# Altium schematic sheet RF_PLL_channel.SchDoc: RFSOC SAWG
size 420 x 297 mm; Author: G.Kasprowicz; CompanyName: WUT; DrawnBy: G.Kasprowicz; Organization: WUT ISE; Address1: Warsaw Univeristy of Technology; Address2: Nowowiejska 15/19; DocumentNumber: 18; Revision: 1; SheetNumber: 18; SheetTotal: 20; EDA_Number: ARTIQ; Projet: ARTIQ/SINARA; ModifiedBy: -; CreateDate: XX/XX/XXXX; CheckedDate: -; Title2: RF PLL; DivGrp: ISE; Designer: G.Kasprowicz; ModifiedDate: -; ProjectName: ARTIQ/SINARA
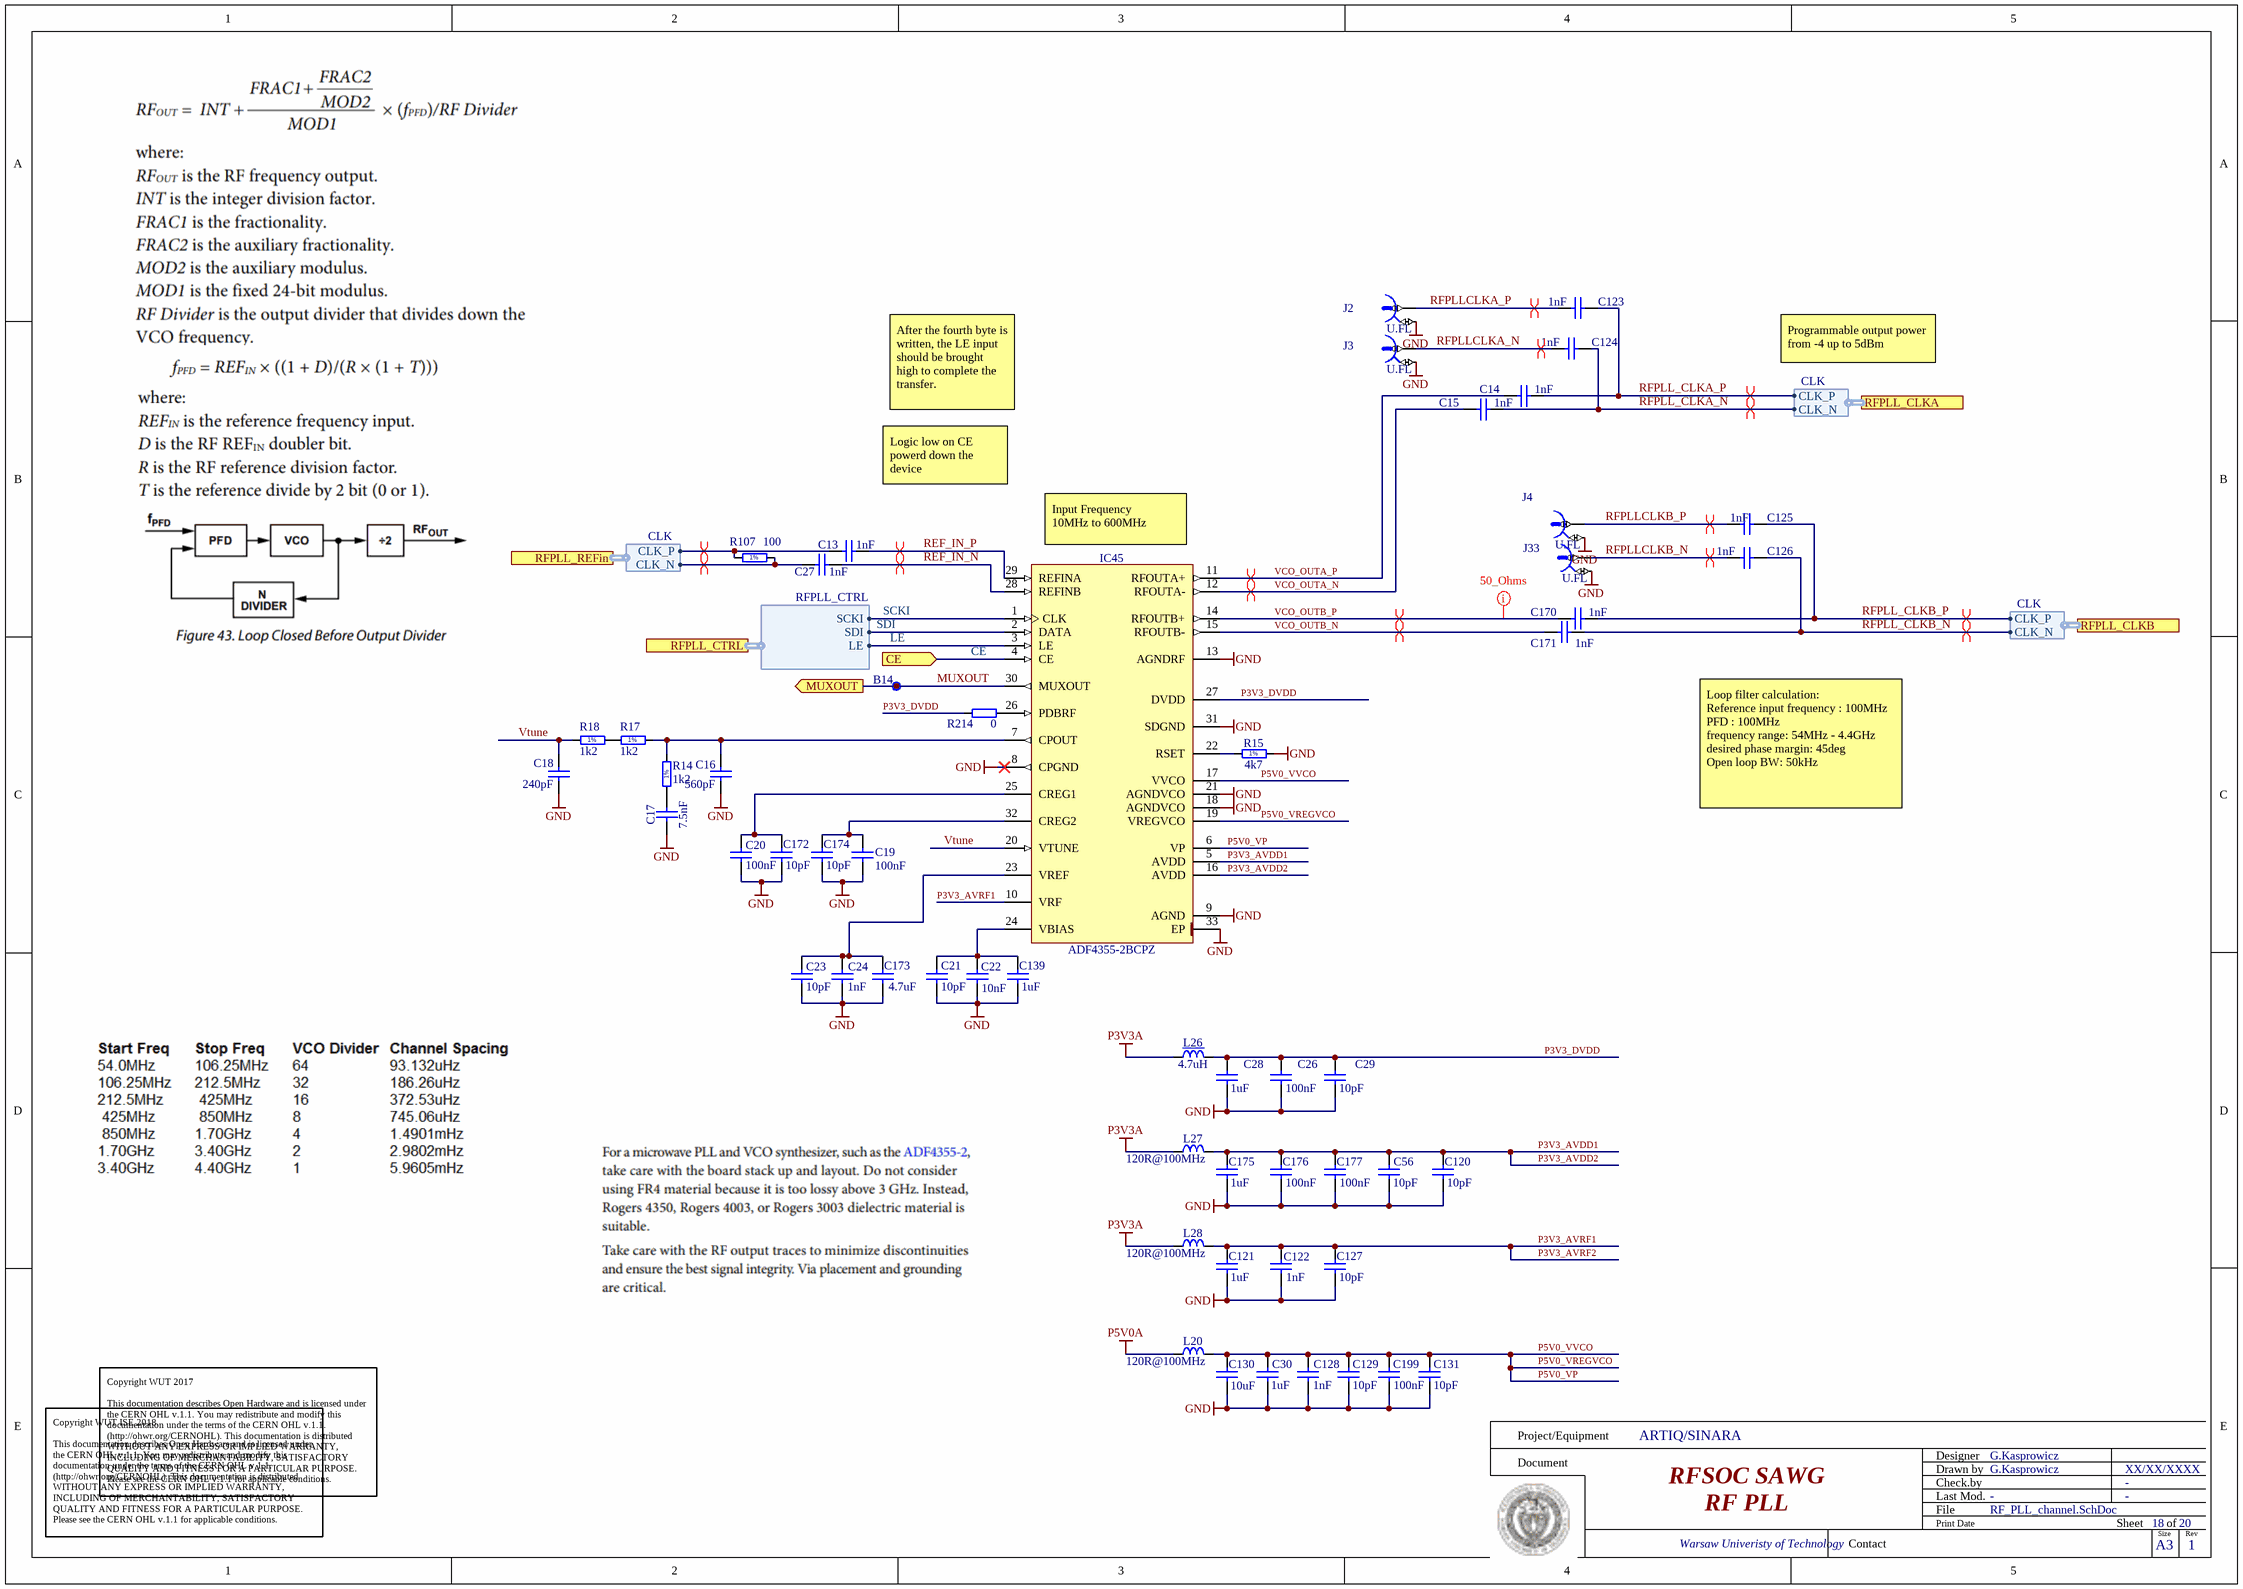
[diagram p0: RF_PLL_channel.SchDoc]

## Parts
B14  SMD Pad  [C100]  (value not drawn)  (no BOM)
C13  1nF  [CAPC1005X55N]
C14  1nF  [CAPC1005X55N]
C15  1nF  [CAPC1005X55N]
C16  560pF  [CAPC1005X55N]
C17  7.5nF  [CAPC1608X87N]
C18  240pF  [CAPC1005X55N]
C19  100nF  [CAPC1005X55N]
C20  100nF  [CAPC1005X55N]
C21  10pF  [CAPC1005X55N]
C22  10nF  [CAPC1005X55N]
C23  10pF  [CAPC1005X55N]
C24  1nF  [CAPC1005X55N]
C26  100nF  [CAPC1005X55N]
C27  1nF  [CAPC1005X55N]
C28  1uF  [CAPC1005X55N]
C29  10pF  [CAPC1005X55N]
C30  1uF  [CAPC1005X55N]
C56  10pF  [CAPC1005X55N]
C120  10pF  [CAPC1005X55N]
C121  1uF  [CAPC1005X55N]
C122  1nF  [CAPC1005X55N]
C123  1nF  [CAPC1005X55N]
C124  1nF  [CAPC1005X55N]
C125  1nF  [CAPC1005X55N]
C126  1nF  [CAPC1005X55N]
C127  10pF  [CAPC1005X55N]
C128  1nF  [CAPC1005X55N]
C129  10pF  [CAPC1005X55N]
C130  10uF  [CAPC1608X80N]
C131  10pF  [CAPC1005X55N]
C139  1uF  [CAPC1005X55N]
C170  1nF  [CAPC1005X55N]
C171  1nF  [CAPC1005X55N]
C172  10pF  [CAPC1005X55N]
C173  4.7uF  [CAPC1608X80N]
C174  10pF  [CAPC1005X55N]
C175  1uF  [CAPC1005X55N]
C176  100nF  [CAPC1005X55N]
C177  100nF  [CAPC1005X55N]
C199  100nF  [CAPC1005X55N]
IC45  ADF4355-2BCPZ  [QFN50P500X500X80-33N-S375]
J2  U.FL  [HIROSE_U.FL-R-SMT-1(10)]
J3  U.FL  [HIROSE_U.FL-R-SMT-1(10)]
J4  U.FL  [HIROSE_U.FL-R-SMT-1(10)]
J33  U.FL  [HIROSE_U.FL-R-SMT-1(10)]
L20  120R@100MHz  [INDC1608X95N]
L26  4.7uH  [INDC2012X145N]
L27  120R@100MHz  [INDC1608X95N]
L28  120R@100MHz  [INDC1608X95N]
R14  1k2  [RESC1005X40N]
R15  4k7  [RESC1005X40N]
R17  1k2  [RESC1005X40N]
R18  1k2  [RESC1005X40N]
R107  100  [RESC1005X40N]
R214  0  [RESC1005X40N]

## Ports
CE (in), MUXOUT (out), RFPLL_CLKA (harness CLK), RFPLL_CLKB (harness CLK), RFPLL_CTRL (harness RFPLL_CTRL), RFPLL_REFin (harness CLK)

## Harnesses
CLK: CLK_P, CLK_N
RFPLL_CTRL: SCKI, SDI, LE

## Nets
GND: C16.1 C17.1 C18.1 C19.1 C20.1 C21.1 C22.1 C23.1 C24.1 C26.1 C28.1 C29.1 C30.1 C56.1 C120.1 C121.1 C122.1 C127.1 C128.1 C129.1 C130.1 C131.1 C139.1 C172.1 C173.1 C174.1 C175.1 C176.1 C177.1 C199.1 IC45.8(CPGND) IC45.9(AGND) IC45.13(AGNDRF) IC45.18(AGNDVCO) IC45.21(AGNDVCO) IC45.31(SDGND) IC45.33(EP) J2.2 J3.2 J4.2 J33.2 R15.2
P3V3A: L26.1 L27.2 L28.2
P5V0A: L20.2
CE: IC45.4(CE) ; port CE
LE: IC45.3(LE) ; port RFPLL_CTRL.LE
MUXOUT: B14.1 IC45.30(MUXOUT) ; port MUXOUT
P3V3_AVDD1: C56.2 C120.2 C175.2 C176.2 C177.2 IC45.5(AVDD) IC45.16(AVDD) L27.1  [also labelled P3V3_AVDD2]
P3V3_AVRF1: C121.2 C122.2 C127.2 IC45.10(VRF) L28.1  [also labelled P3V3_AVRF2]
P3V3_DVDD: C26.2 C28.2 C29.2 IC45.27(DVDD) L26.2 R214.1
P5V0_VP: C30.2 C128.2 C129.2 C130.2 C131.2 C199.2 IC45.6(VP) IC45.17(VVCO) IC45.19(VREGVCO) L20.1  [also labelled P5V0_VREGVCO, P5V0_VVCO]
REF_IN_N: C27.2 IC45.28(REFINB)
REF_IN_P: C13.2 IC45.29(REFINA)
RFPLL_CLKA_N: C15.2 C124.1 ; port RFPLL_CLKA.CLK_N
RFPLL_CLKA_P: C14.2 C123.1 ; port RFPLL_CLKA.CLK_P
RFPLL_CLKB_N: C126.1 C171.2 ; port RFPLL_CLKB.CLK_N
RFPLL_CLKB_P: C125.1 C170.2 ; port RFPLL_CLKB.CLK_P
RFPLLCLKA_N: C124.2 J3.1
RFPLLCLKA_P: C123.2 J2.1
RFPLLCLKB_N: C126.2 J33.1
RFPLLCLKB_P: C125.2 J4.1
SCKI: IC45.1(CLK) ; port RFPLL_CTRL.SCKI
SDI: IC45.2(DATA) ; port RFPLL_CTRL.SDI
VCO_OUTA_N: C15.1 IC45.12(RFOUTA-)
VCO_OUTA_P: C14.1 IC45.11(RFOUTA+)
VCO_OUTB_N: C171.1 IC45.15(RFOUTB-)
VCO_OUTB_P: C170.1 IC45.14(RFOUTB+)
Vtune: C18.2 IC45.20(VTUNE) R18.2
NetC13_1: C13.1 R107.1 ; port RFPLL_REFin.CLK_P
NetC16_2: C16.2 IC45.7(CPOUT) R14.2 R17.1
NetC17_2: C17.2 R14.1
NetC19_2: C19.2 C174.2 IC45.32(CREG2)
NetC20_2: C20.2 C172.2 IC45.25(CREG1)
NetC21_2: C21.2 C22.2 C139.2 IC45.24(VBIAS)
NetC23_2: C23.2 C24.2 C173.2 IC45.23(VREF)
NetC27_1: C27.1 R107.2 ; port RFPLL_REFin.CLK_N
NetIC45_22: IC45.22(RSET) R15.1
NetIC45_26: IC45.26(PDBRF) R214.2
NetR17_2: R17.2 R18.1

## Layout directives
differential pair: NetC13_1, NetC27_1, REF_IN_N, REF_IN_P, RFPLL_CLKA_N, RFPLL_CLKA_P, RFPLL_CLKB_N, RFPLL_CLKB_P, RFPLLCLKA_N, RFPLLCLKA_P, RFPLLCLKB_N, RFPLLCLKB_P, VCO_OUTA_N, VCO_OUTA_P, VCO_OUTB_N, VCO_OUTB_P
net class 50_Ohms: VCO_OUTB_P

## Notes on the sheet
- Programmable output power from -4 up to 5dBm
- After the fourth byte is written, the LE input should be brought high to complete the transfer.
- Logic low on CE powerd down the device
- (near IC45) Input Frequency
  10MHz to 600MHz
- Loop filter calculation:
  Reference input frequency : 100MHz
  PFD : 100MHz
  frequency range: 54MHz - 4.4GHz
  desired phase margin: 45deg
  Open loop BW: 50kHz
- Copyright WUT 2017
  This documentation describes Open Hardware and is licensed under the CERN OHL v.1.1. You may redistribute and modify this documentation under the terms of the CERN OHL v.1.1. (http://ohwr.org/CERNOHL). This documentation is distributed WITHOUT ANY EXPRESS OR IMPLIED WARRANTY, INCLUDING OF MERCHANTABILITY, SATISFACTORY QUALITY AND FITNESS FOR A PARTICULAR PURPOSE. Please see the CERN OHL v.1.1 for applicable conditions.
- Project/Equipment
- Document
- Designer
- Drawn by
- Check.by
- Copyright WUT ISE 2018.
  This documentation describes Open Hardware and is licensed under the CERN OHL v.1.1. You may redistribute and modify this documentation under the terms of the CERN OHL v.1.1. (http://ohwr.org/CERNOHL). This documentation is distributed WITHOUT ANY EXPRESS OR IMPLIED WARRANTY, INCLUDING OF MERCHANTABILITY, SATISFACTORY QUALITY AND FITNESS FOR A PARTICULAR PURPOSE. Please see the CERN OHL v.1.1 for applicable conditions.
- Contact
- File
- Last Mod.
- Print Date
- Sheet
- Size
- A3
- of
- Rev
- (in symbol R0402_4K7_1%_0.0625W_100PPM) 1%
- (in symbol R0402_49R9_1%_0.0625W_100PPM) 1%
- (in symbol R0402_100R_1%_0.0625W_100PPM) 1%

## Library data of the parts
B14 = SMD_PAD_D1MM: Through Hole Pad; Part Description: 1mm Diameter SMD Pad; Mounted: No; Part Number: SMD_PAD_D1MM; Component Type: Standard (No BOM); Pin Count: 1; Family: SMD Pad; Socket: No; SMD: No; Sense: No; Status: None; ComponentHeight: 0mm; HelpURL: Undefined; Author: CERN DEM JLC; CreateDate: 10.10.2017; LatestRevisionDate: 10.10.2017; PackageDescription: 1mm Diameter SMD Pad
C13-C15 C24 C27 C122-C126 C128 C170 C171 = CC0402_1NF_50V_10%_X7R: Non-polarised capacitor; Part Description: SMD Multilayer Chip Ceramic Capacitor; Manufacturer: GENERIC; Manufacturer1 Part Number: 223858715623; Voltage: 50V; TC: X7R; Tolerance: ±10%; Part Number: CC0402_1NF_50V_10%_X7R; Component Kind: Standard; Component Type: Standard; Pin Count: 2; Value: 1nF; Status: Not Recommended; Manufacturer Part Number: CC0402_1NF_50V_10%_X7R; Case: 0402; Mounted: Yes; Socket: No; SMD: Yes; Sense: No; Manufacturer1 Example: PHYCOMP; Manufacturer1 ComponentHeight: 0.55mm; HelpURL: \\cern.ch\dfs\Applications\Altium\Datasheets\CC0402_X7R_PHYCOMP.pdf; Author: CERN DEM JLC; CreateDate: 03.12.2007; LatestRevisionDate: 03.12.2007
C16 = CC0402_10PF_50V_5%_C0G: Non-polarised capacitor; Part Number: CC0402_560PF_50V_5%_C0G; Part Description: SMD Multilayer Chip Ceramic Capacitor; Manufacturer: GENERIC; Manufacturer1 Part Number: GCM1555C1H561JA16D; Voltage: 50V; TC: C0G/NP0; Tolerance: ±5%; Component Kind: Standard; Component Type: Standard; Pin Count: 2; Value: 560pF; Status: Preferred; Manufacturer Part Number: CC0402_560PF_50V_5%_C0G; Case: 0402; Mounted: Yes; Socket: No; SMD: Yes; Sense: No; Manufacturer1 Example: Murata; Manufacturer1 ComponentHeight: 0.55mm; HelpURL: \\cern.ch\dfs\Applications\Altium\Datasheets\CC0805_C0G_KEMET_(Commercial Grade).pdf; Author: CERN DEM JLC; CreateDate: 2007-12-03; LatestRevisionDate: 2015-04-22
C17 = CC0603_7.5NF_25V_5%_C0G: Non-polarised capacitor; Part Description: SMD Multilayer Chip Ceramic Capacitor; Manufacturer: GENERIC; Manufacturer1 Part Number: C0603C752J3GACTU; Voltage: 25V; TC: C0G/NP0; Tolerance: ±5%; Part Number: CC0603_7.5NF_25V_5%_C0G; Component Kind: Standard; Component Type: Standard; Pin Count: 2; Value: 7.5nF; Status: Preferred; Manufacturer Part Number: CC0603_7.5NF_25V_5%_C0G; Case: 0603; Mounted: Yes; Socket: No; SMD: Yes; Sense: No; Manufacturer1 Example: KEMET; Manufacturer1 ComponentHeight: 0.87mm; HelpURL: \\cern.ch\dfs\Applications\Altium\Datasheets\CC0603_C0G_KEMET.pdf; Author: CERN DEM JLC; CreateDate: 01.10.2013; LatestRevisionDate: 01.10.2013
C18 = CC0402_10PF_50V_5%_C0G: Non-polarised capacitor; Part Number: CC0402_240PF_50V_5%_C0G; Part Description: SMD Multilayer Chip Ceramic Capacitor; Manufacturer: GENERIC; Manufacturer1 Part Number: GRM1555C1H241JA01D; Voltage: 50V; TC: C0G/NP0; Tolerance: ±5%; Component Kind: Standard; Component Type: Standard; Pin Count: 2; Value: 240pF; Status: Preferred; Manufacturer Part Number: CC0402_240PF_50V_5%_C0G; Case: 0402; Mounted: Yes; Socket: No; SMD: Yes; Sense: No; Manufacturer1 Example: MURATA; Manufacturer1 ComponentHeight: 0.55mm; HelpURL: \\cern.ch\dfs\Applications\Altium\Datasheets\CC0805_C0G_KEMET_(Commercial Grade).pdf; Author: CERN DEM JLC; CreateDate: 2007-12-03; LatestRevisionDate: 2015-04-22
C19 C20 C26 C176 C177 C199 = CC0402_100NF_16V_10%_X5R: Non-polarised capacitor; Part Description: SMD Multilayer Chip Ceramic Capacitor; Manufacturer: GENERIC; Manufacturer1 Part Number: GRM155R61C104KA88D; Voltage: 16V; TC: X5R; Tolerance: ±10%; Part Number: CC0402_100NF_16V_10%_X5R; Component Kind: Standard; Component Type: Standard; Pin Count: 2; Value: 100nF; Status: None; Manufacturer Part Number: CC0402_100NF_16V_10%_X5R; Case: 0402; Mounted: Yes; Socket: No; SMD: Yes; Sense: No; Manufacturer1 Example: MURATA; Manufacturer1 ComponentHeight: 0.55mm; HelpURL: \\cern.ch\dfs\Applications\Altium\Datasheets\CC0402_X5R_MURATA_GRM.pdf; Author: CERN DEM JLC; CreateDate: 10.12.2013; LatestRevisionDate: 10.12.2013
C21 C23 C29 C56 C120 C127 C129 C131 C172 C174 = CC0402_10PF_50V_5%_C0G: Non-polarised capacitor; Part Description: SMD Multilayer Chip Ceramic Capacitor; Manufacturer: GENERIC; Manufacturer1 Part Number: C0402C100J5GACTU; Voltage: 50V; TC: C0G/NP0; Tolerance: ±5%; Part Number: CC0402_10PF_50V_5%_C0G; Component Kind: Standard; Component Type: Standard; Pin Count: 2; Value: 10pF; Status: Preferred; Manufacturer Part Number: CC0402_10PF_50V_5%_C0G; Case: 0402; Mounted: Yes; Socket: No; SMD: Yes; Sense: No; Manufacturer1 Example: KEMET; Manufacturer1 ComponentHeight: 0.55mm; HelpURL: \\cern.ch\dfs\Applications\Altium\Datasheets\CC0805_C0G_KEMET_(Commercial Grade).pdf; Author: CERN DEM JLC; CreateDate: 2007-12-03; LatestRevisionDate: 2015-04-22
C22 = CC0402_10NF_16V_10%_X7R: Non-polarised capacitor; Part Description: SMD Multilayer Chip Ceramic Capacitor; Manufacturer: GENERIC; Manufacturer1 Part Number: 223878715636; Voltage: 16V; TC: X7R; Tolerance: ±10%; Part Number: CC0402_10NF_16V_10%_X7R; Component Kind: Standard; Component Type: Standard; Pin Count: 2; Value: 10nF; Status: Not Recommended; Manufacturer Part Number: CC0402_10NF_16V_10%_X7R; Case: 0402; Mounted: Yes; Socket: No; SMD: Yes; Sense: No; Manufacturer1 Example: PHYCOMP; Manufacturer1 ComponentHeight: 0.55mm; HelpURL: \\cern.ch\dfs\Applications\Altium\Datasheets\CC0402_X7R_PHYCOMP.pdf; Author: CERN DEM JLC; CreateDate: 03.12.2007; LatestRevisionDate: 03.12.2007
C28 C30 C121 C139 C175 = CC0402_1UF_16V_10%_X5R: Non-polarised capacitor; Part Description: SMD Multilayer Chip Ceramic Capacitor; Manufacturer: GENERIC; Manufacturer1 Part Number: C1005X5R1C105KT; Voltage: 16V; TC: X5R; Tolerance: ±10%; Part Number: CC0402_1UF_16V_10%_X5R; Component Kind: Standard; Component Type: Standard; Pin Count: 2; Value: 1uF; Status: Preferred; Manufacturer Part Number: CC0402_1UF_16V_10%_X5R; Case: 0402; Mounted: Yes; Socket: No; SMD: Yes; Sense: No; Manufacturer1 Example: TDK; Manufacturer1 ComponentHeight: 0.55mm; HelpURL: \\cern.ch\dfs\Applications\Altium\Datasheets\CC0402_X5R_TDK_C.pdf; Author: CERN DEM JLC; CreateDate: 2012-10-25; LatestRevisionDate: 2012-10-25
C130 = CC0603_10UF_16V_20%_X5R: Non-polarised capacitor; Part Description: SMD Multilayer Chip Ceramic Capacitor; Manufacturer: GENERIC; Manufacturer1 Part Number: GRM188R61C106MA73D; Voltage: 16V; TC: X5R; Tolerance: ±20%; Part Number: CC0603_10UF_16V_20%_X5R; Component Kind: Standard; Component Type: Standard; Pin Count: 2; Value: 10uF; Status: None; Manufacturer Part Number: CC0603_10UF_16V_20%_X5R; Case: 0603; Mounted: Yes; Socket: No; SMD: Yes; Sense: No; Manufacturer1 Example: MURATA; Manufacturer1 ComponentHeight: 0.8mm; HelpURL: \\cern.ch\dfs\Applications\Altium\Datasheets\CC0603_X5R_MURATA_GRM.pdf; Author: CERN DEM MR; CreateDate: 2016-03-02; LatestRevisionDate: 2016-03-02
C173 = CC0603_10UF_16V_20%_X5R: Non-polarised capacitor; Part Number: CC0603_4U7F_16V_10%_X5R; Part Description: SMD Multilayer Chip Ceramic Capacitor; Manufacturer: GENERIC; Manufacturer1 Part Number: C1608X5R1C475K080AC; Voltage: 16V; TC: X5R; Tolerance: ±10%; Component Kind: Standard; Component Type: Standard; Pin Count: 2; Value: 4.7uF; Status: None; Manufacturer Part Number: CC0603_4U7F_16V_10%_X5R; Case: 0603; Mounted: Yes; Socket: No; SMD: Yes; Sense: No; Manufacturer1 Example: TDK; Manufacturer1 ComponentHeight: 0.8mm; HelpURL: \\cern.ch\dfs\Applications\Altium\Datasheets\CC0603_X5R_MURATA_GRM.pdf; Author: CERN DEM MR; CreateDate: 2016-03-02; LatestRevisionDate: 2016-03-02
IC45 = ADF4355-2BCPZ: Microwave Wideband Synthesizer with Integrated VCO; Manufacturer: ANALOG DEVICES; PressFit: No; Bonding: No; Part Number: ADF4355-2BCPZ; Component Kind: Standard; Component Type: Standard; Device: ADF4355-2BCPZ; PackageDescription: QFN, (MO-220-WHHD-5) 0.50mm Pitch, Square; 32 Pin, 5.00mm L X 5.00mm W X 0.80mm H body (w/Thermal Tab 3.75 X 3.75mm), IPC Medium Density; Part Description: Microwave Wideband Synthesizer with Integrated VCO; Manufacturer Part Number: ADF4355-2BCP; Pin Count: 33; Case: QFN32; Mounted: Yes; Socket: No; SMD: Yes; Sense: No; ComponentHeight: 0.8mm; Author: CERN DEM BC; HelpURL: \\cern.ch\dfs\Applications\Altium\Datasheets\ADF4355-2BCPZ.pdf; CreateDate: 21.07.2021; LatestRevisionDate: 22.03.2022
J2-J4 J33 = HIROSE_U.FL-R-SMT-1(10): Part Description: Up to 6GHz Ultra Small Surface Mount Male Coaxial Connectors U.FL Series; Manufacturer: HIROSE (HRS); PressFit: No; Part Number: HIROSE_U.FL-R-SMT-1(10); Component Kind: Standard; Component Type: Standard; Pin Count: 2; Family: U.FL; Mounted: Yes; Socket: No; SMD: Yes; Sense: No; Status: None; Manufacturer Part Number: U.FL-R-SMT-1(10); ComponentHeight: 1.25mm; HelpURL: \\cern.ch\dfs\Applications\Altium\Datasheets\HIROSE_U.FL-R-SMT-1(10).pdf; Author: CERN DEM JLC; CreateDate: 24.03.2010; LatestRevisionDate: 24.03.2010
L20 L27 L28 = IND0603_MURATA_BLM18PG121SN1D: Inductor; Part Description: SMD EMIFIL Chip Ferrite Bead; Manufacturer: MURATA; Power: 2A; Resistance: 0.05R; Part Number: IND0603_MURATA_BLM18PG121SN1D; Component Kind: Standard; Component Type: Standard; Pin Count: 2; Value: 120R@100MHz; Status: None; Manufacturer Part Number: BLM18PG121SN1D; Case: 0603; Mounted: Yes; Socket: No; SMD: Yes; Sense: No; ComponentHeight: 0.95mm; HelpURL: \\cern.ch\dfs\Applications\Altium\Datasheets\IND0603_MURATA_BLM18P.pdf; Author: CERN DEM BC; CreateDate: 2015-07-27; LatestRevisionDate: 2015-07-27
L26 = IND0805_4.7UH_20%_KEMET_L-DWI: Inductor With Core; Part Description: Wire Wound Chip Inductors; Manufacturer: KEMET; Manufacturer Part Number: L0805C4R7MDWIT; Power: 360mA; Resistance: 0.5R; Tolerance: ±20%; Part Number: IND0805_4.7UH_20%_KEMET_L-DWI; Component Kind: Standard; Component Type: Standard; Pin Count: 2; Value: 4.7uH; Status: None; Case: 0805; Mounted: Yes; Socket: No; SMD: Yes; Sense: No; ComponentHeight: 1.45mm; HelpURL: \\cern.ch\dfs\Applications\Altium\Datasheets\IND0805_KEMET_L-DWI .pdf; Author: CERN DEM JLC; CreateDate: 26.01.2010; LatestRevisionDate: 26.01.2010
R14 R17 R18 = R0402_49R9_1%_0.0625W_100PPM: Resistor - 1%; Part Number: R0402_1K2_1%_0.0625W_100PPM; Part Description: General Purpose Thick Film Chip Resistor; Manufacturer: GENERIC; Manufacturer1 Part Number: NRC04F1201TRF; TC: ±100ppm/°C; PressFit: No; Component Kind: Standard; Component Type: Standard; Pin Count: 2; Value: 1k2; Status: Preferred; Power: 0.0625W; Tolerance: ±1%; Manufacturer Part Number: R0402_1K2_1%_0.0625W_100PPM; Case: 0402; Mounted: Yes; Sense: No; Socket: No; SMD: Yes; Manufacturer1 Example: NIC COMPONENT; Manufacturer1 ComponentHeight: 0.4mm; HelpURL: \\cern.ch\dfs\Applications\Altium\Datasheets\R0402_Phycomp_RC0402.pdf; Author: CERN DEM JLC; CreateDate: 24.10.2012; LatestRevisionDate: 24.10.2012
R15 = R0402_4K7_1%_0.0625W_100PPM: Resistor - 1%; Part Description: General Purpose Thick Film Chip Resistor; Manufacturer: GENERIC; Manufacturer1 Part Number: 232270674702L; TC: ±100ppm/°C; Part Number: R0402_4K7_1%_0.0625W_100PPM; Component Kind: Standard; Component Type: Standard; Pin Count: 2; Value: 4k7; Status: Not recommended; Power: 0.0625W; Tolerance: ±1%; Manufacturer Part Number: R0402_4K7_1%_0.0625W_100PPM; Case: 0402; Mounted: Yes; Sense: No; Socket: No; SMD: Yes; Manufacturer1 Example: YAGEO PHYCOMP; Manufacturer1 ComponentHeight: 0.4mm; HelpURL: \\cern.ch\dfs\Applications\Altium\Datasheets\R0402_Phycomp_RC0402.pdf; Author: CERN DEM JLC; CreateDate: 2007-12-03; LatestRevisionDate: 2012-10-17
R107 = R0402_100R_1%_0.0625W_100PPM: Resistor - 1%; Part Description: General Purpose Thick Film Chip Resistor; Manufacturer: GENERIC; Manufacturer1 Part Number: 232270671001L; TC: ±100ppm/°C; PressFit: No; Part Number: R0402_100R_1%_0.0625W_100PPM; Component Kind: Standard; Component Type: Standard; Pin Count: 2; Value: 100; Status: Not Recommended; Power: 0.0625W; Tolerance: ±1%; Manufacturer Part Number: R0402_100R_1%_0.0625W_100PPM; Case: 0402; Mounted: Yes; Sense: No; Socket: No; SMD: Yes; Manufacturer1 Example: YAGEO PHYCOMP; Manufacturer1 ComponentHeight: 0.4mm; HelpURL: \\cern.ch\dfs\Applications\Altium\Datasheets\R0402_Phycomp_RC0402.pdf; Author: CERN DEM JLC; CreateDate: 03.12.2007; LatestRevisionDate: 17.10.2012
R214 = R0402_0R_JUMPER: Resistor; Part Description: 1A (0.05R Max DC Resistance) Zero Ohm Jumper; Manufacturer: GENERIC; Manufacturer1 Part Number: 232270591001L; PressFit: No; Part Number: R0402_0R_JUMPER; Component Kind: Standard; Component Type: Standard; Pin Count: 2; Value: 0; Status: Not Recommended; Manufacturer Part Number: R0402_0R_JUMPER; Case: 0402; Mounted: Yes; Sense: No; Socket: No; SMD: Yes; Manufacturer1 Example: YAGEO PHYCOMP; Manufacturer1 ComponentHeight: 0.4mm; HelpURL: \\cern.ch\dfs\Applications\Altium\Datasheets\R0402_Phycomp_RC0402.pdf; Author: CERN DEM JLC; CreateDate: 03.12.2007; LatestRevisionDate: 17.10.2012